# EAGLE board Register Board 2.1 (EAGLE 6.5.0), part 1 of 2
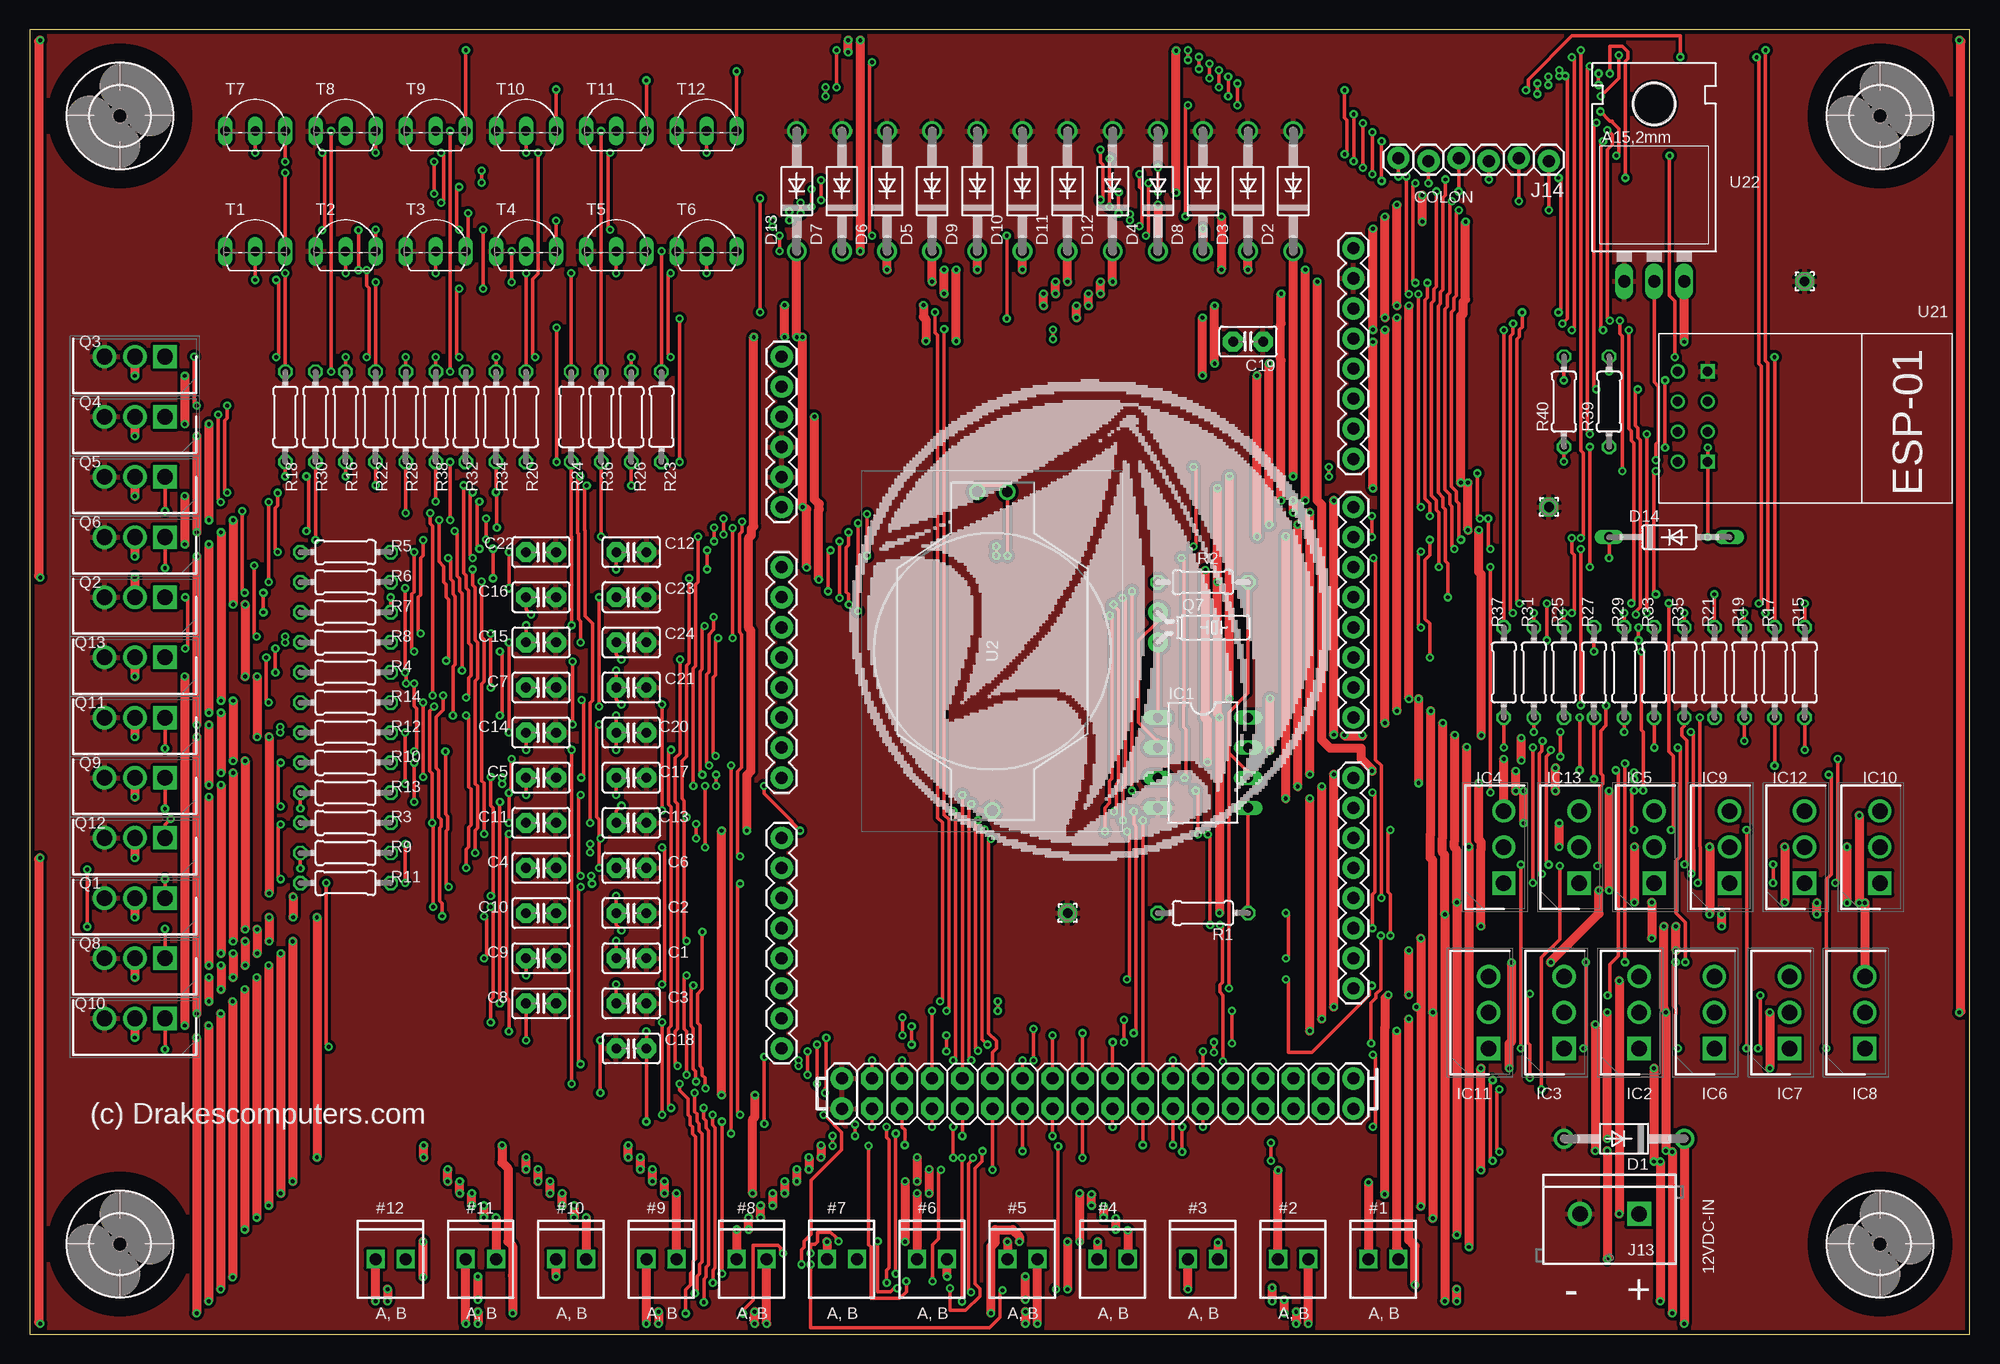
[diagram p3: board, top side]
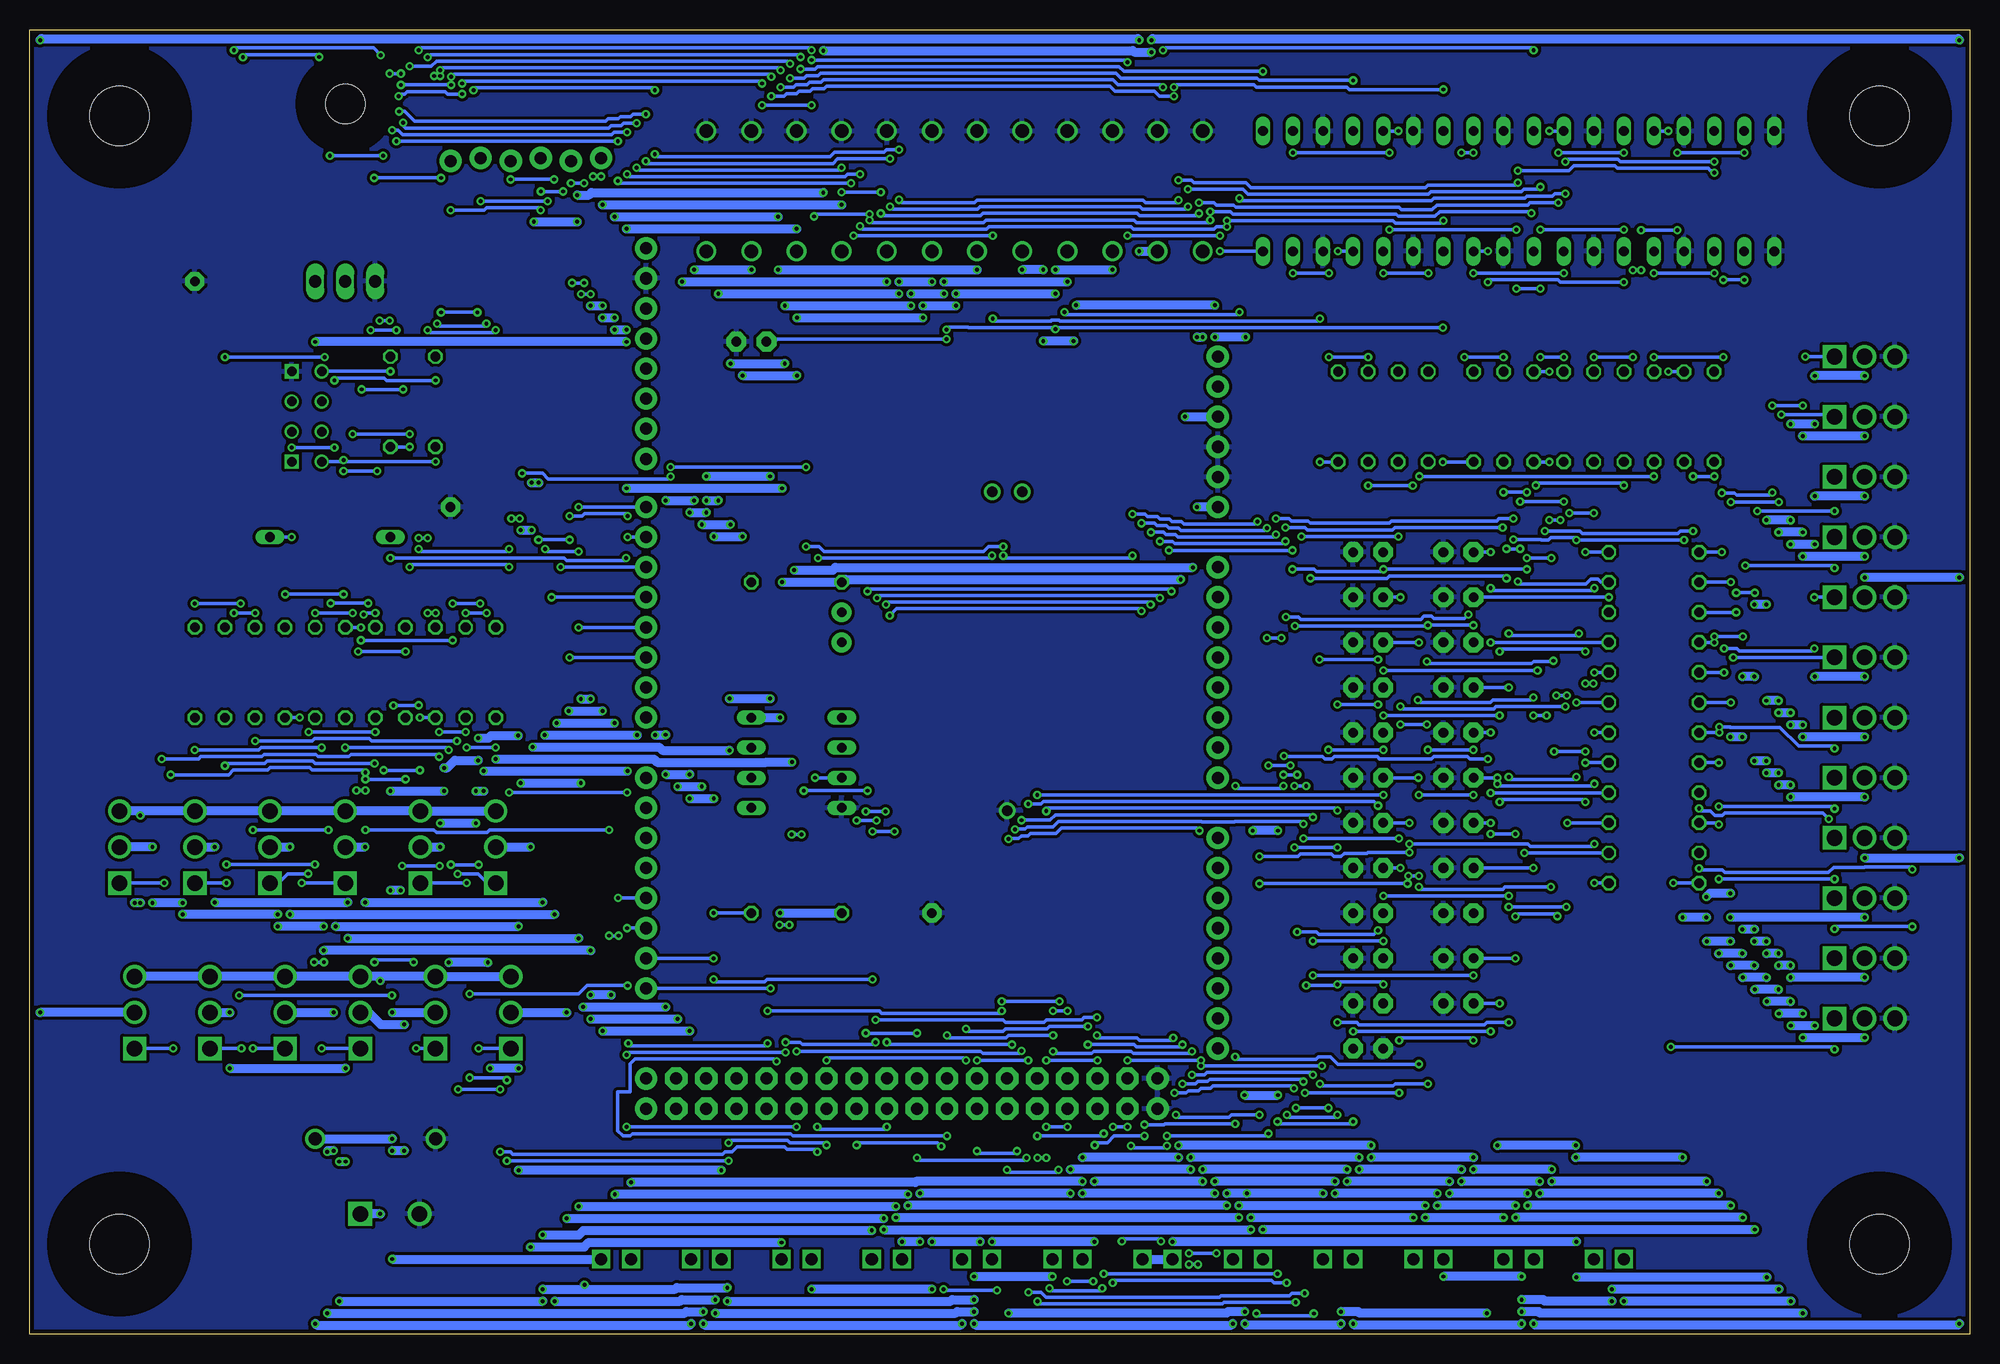
[diagram p4: board, bottom side, seen from below]

Size 163.81 x 110.16 mm. Coordinates in mm from the lower left corner, seen from the top.
Outline: 0,0 163.81,0 163.81,110.16 0,110.16 0,0
Copper layers (1*16): Top 0.0356mm / dielectric 1.5011mm / Bottom 0.0356mm
Design rules "OSH PCB Rules": minimum track width 6mil, minimum drill 13mil, track to track 6mil, track to pad 6mil, pad to pad 6mil, via to via 6mil, smd to smd 6mil, copper to edge 15mil, drill to drill 6mil, minimum pad ring 7mil, minimum via ring 7mil, stop-mask expansion 3mil, vias tented up to drill 13mil, thermal gap 10mil
Net classes: 0 default: width 0.305 mm, clearance 0.254 mm; 1 PWR: width 0.762 mm, clearance 0.254 mm

## Footprints (pad centres in the part's own frame; a part is rotated, then mirrored left to right if it is on the bottom)
C025-025X050 = drill 0.813 pad 1.676 octagon: 1 -1.27,0; 2 1.27,0
DO41-10 = drill 1.118: A 5.08,0; C -5.08,0
DO35-10 = drill 0.813 long: A 5.08,0; C -5.08,0
5,0 = hole 5: 0,0
DIL08 = drill 0.813 long: 1 -3.81,-3.81; 2 -1.27,-3.81; 3 1.27,-3.81; 4 3.81,-3.81; 5 3.81,3.81; 6 1.27,3.81; 7 -1.27,3.81; 8 -3.81,3.81
TO304P498X1010X2089-3P = drill 1.31 pad 1.965 square: 1 0,0 | drill 1.31 pad 1.965: 2 3.04,0; 3 6.08,0
1X02_2.54_SCREWTERM = drill 1.016 square: P1 2.54,0; P2 0,0
SCREWTERMINAL-5MM-2 = drill 1.3 pad 2.032 square: 1 0,0 | drill 1.3 pad 2.032: 2 5,0
1X06_LOCK = drill 1.016 pad 1.88: 1 0,0; 2 2.54,-0.254; 3 5.08,0; 4 7.62,-0.254; 5 10.16,0; 6 12.7,-0.254
1,6/0,8 = drill 0.813 pad 1.6 octagon: 1 0,0
TO255P460X1020X2008-3P = drill 1.32 pad 1.98 square: 1 0,0 | drill 1.32 pad 1.98: 2 2.55,0; 3 5.1,0
TC26H = drill 0.813 pad 1.676: 1 -1.27,0; 2 1.27,0
0204/7 = drill 0.813 octagon: 1 -3.81,0; 2 3.81,0
TO92-EBC-OVAL = drill 0.813 long: B 0,-1.27; C 2.54,-1.27; E -2.54,-1.27
ARDUINO_MEGA_PINSONLY = drill 1.016 pad 1.88: 0 16.51,22.86; 1 13.97,22.86; 2 11.43,22.86; 3 8.89,22.86; 3.3V -11.43,-25.4; 4 6.35,22.86; 5 3.81,22.86; 5V@0 -8.89,-25.4; 5V@1 46.99,22.86; 5V@2 49.53,22.86; 6 1.27,22.86; 7 -1.27,22.86; 8 -5.334,22.86; 9 -7.874,22.86; 10 -10.414,22.86; 11 -12.954,22.86; 12 -15.494,22.86; 13 -18.034,22.86; 14 21.59,22.86; 15 24.13,22.86; 16 26.67,22.86; 17 29.21,22.86; 18 31.75,22.86; 19 34.29,22.86; 20 36.83,22.86; 21 39.37,22.86; A0 3.81,-25.4; A1 6.35,-25.4; A2 8.89,-25.4; A3 11.43,-25.4; A4 13.97,-25.4; A5 16.51,-25.4; A6 19.05,-25.4; A7 21.59,-25.4; A8 26.67,-25.4; A9 29.21,-25.4; A10 31.75,-25.4; A11 34.29,-25.4; A12 36.83,-25.4; A13 39.37,-25.4; A14 41.91,-25.4; A15 44.45,-25.4; AREF -23.114,22.86; GND@0 -6.35,-25.4; GND@1 -3.81,-25.4; GND@2 46.99,-20.32; GND@3 49.53,-20.32; GND@4 -20.574,22.86; RESET -13.97,-25.4; VIN -1.27,-25.4 | drill 1.016 pad 1.88 octagon: 22 46.99,20.32; 23 49.53,20.32; 24 46.99,17.78; 25 49.53,17.78; 26 46.99,15.24; 27 49.53,15.24; 28 46.99,12.7; 29 49.53,12.7; 30 46.99,10.16; 31 49.53,10.16; 32 46.99,7.62; 33 49.53,7.62; 34 46.99,5.08; 35 49.53,5.08; 36 46.99,2.54; 37 49.53,2.54; 38 46.99,0; 39 49.53,0; 40 46.99,-2.54; 41 49.53,-2.54; 42 46.99,-5.08; 43 49.53,-5.08; 44 46.99,-7.62; 45 49.53,-7.62; 46 46.99,-10.16; 47 49.53,-10.16; 48 46.99,-12.7; 49 49.53,-12.7; 50 46.99,-15.24; 51 49.53,-15.24; 52 46.99,-17.78; 53 49.53,-17.78
HU2032LF = drill 0.9 pad 1.4: 1 0,0; 2 0,-2.54; 3 26.9,-1.27
ESP01 = drill 0.8: CH_PD -1.285,-8.178; GPIO0 1.255,-5.638; GPIO2 -1.285,-5.638; RST 1.255,-8.178; TX -3.825,-8.178; VCC 3.795,-8.178 | drill 0.8 square: GND -3.825,-5.638; RX 3.795,-5.638
78XXL = drill 1.016 long: GND 0,-3.81; IN -2.54,-3.81; OUT 2.54,-3.81 | hole 3.302: 0,11.176

## Placement (x,y rotation side)
C1  0.1uf  [C025-025X050]  50.8,31.75 180 top
C2  0.1uf  [C025-025X050]  50.8,35.56 180 top
C3  0.1uf  [C025-025X050]  50.8,27.94 180 top
C4  0.1uf  [C025-025X050]  43.18,39.37 180 top
C5  0.1uf  [C025-025X050]  43.18,46.99 180 top
C6  0.1uf  [C025-025X050]  50.8,39.37 180 top
C7  0.1uf  [C025-025X050]  43.18,54.61 180 top
C8  0.1uf  [C025-025X050]  43.18,27.94 180 top
C9  0.1uf  [C025-025X050]  43.18,31.75 180 top
C10  0.1uf  [C025-025X050]  43.18,35.56 180 top
C11  0.1uf  [C025-025X050]  43.18,43.18 180 top
C12  0.1uf  [C025-025X050]  50.8,66.04 180 top
C13  0.1uf  [C025-025X050]  50.8,43.18 180 top
C14  0.1uf  [C025-025X050]  43.18,50.8 180 top
C15  0.1uf  [C025-025X050]  43.18,58.42 180 top
C16  0.1uf  [C025-025X050]  43.18,62.23 180 top
C17  0.1uf  [C025-025X050]  50.8,46.99 180 top
C18  0.1uf  [C025-025X050]  50.8,24.13 0 top
C19  0.1uf  [C025-025X050]  102.87,83.82 180 top
C20  0.1uf  [C025-025X050]  50.8,50.8 180 top
C21  0.1uf  [C025-025X050]  50.8,54.61 180 top
C22  0.1uf  [C025-025X050]  43.18,66.04 180 top
C23  0.1uf  [C025-025X050]  50.8,62.23 180 top
C24  0.1uf  [C025-025X050]  50.8,58.42 180 top
D1  1N4007  [DO41-10]  134.62,16.51 180 top
D2  1N4007  [DO41-10]  106.68,96.52 90 top
D3  1N4007  [DO41-10]  102.87,96.52 90 top
D4  1N4007  [DO41-10]  95.25,96.52 90 top
D5  1N4007  [DO41-10]  76.2,96.52 90 top
D6  1N4007  [DO41-10]  72.39,96.52 90 top
D7  1N4007  [DO41-10]  68.58,96.52 90 top
D8  1N4007  [DO41-10]  99.06,96.52 90 top
D9  1N4007  [DO41-10]  80.01,96.52 90 top
D10  1N4007  [DO41-10]  83.82,96.52 90 top
D11  1N4007  [DO41-10]  87.63,96.52 90 top
D12  1N4007  [DO41-10]  91.44,96.52 90 top
D13  1N4007  [DO41-10]  64.77,96.52 90 top
D14  1N4148  [DO35-10]  138.43,67.31 0 top
H1  MOUNT-HOLE5.0  [5,0]  7.62,102.87 0 top
H2  MOUNT-HOLE5.0  [5,0]  7.62,7.62 0 top
H3  MOUNT-HOLE5.0  [5,0]  156.21,7.62 0 top
H4  MOUNT-HOLE5.0  [5,0]  156.21,102.87 0 top
IC1  DS1307  [DIL08]  99.06,48.26 270 top
IC2  TIP126  [TO304P498X1010X2089-3P]  135.89,24.13 90 top
IC3  TIP126  [TO304P498X1010X2089-3P]  129.54,24.13 90 top
IC4  TIP126  [TO304P498X1010X2089-3P]  124.46,38.1 90 top
IC5  TIP126  [TO304P498X1010X2089-3P]  137.16,38.1 90 top
IC6  TIP126  [TO304P498X1010X2089-3P]  142.24,24.13 90 top
IC7  TIP126  [TO304P498X1010X2089-3P]  148.59,24.13 90 top
IC8  TIP126  [TO304P498X1010X2089-3P]  154.94,24.13 90 top
IC9  TIP126  [TO304P498X1010X2089-3P]  143.51,38.1 90 top
IC10  TIP126  [TO304P498X1010X2089-3P]  156.21,38.1 90 top
IC11  TIP126  [TO304P498X1010X2089-3P]  123.19,24.13 90 top
IC12  TIP126  [TO304P498X1010X2089-3P]  149.86,38.1 90 top
IC13  TIP126  [TO304P498X1010X2089-3P]  130.81,38.1 90 top
J1  [1X02_2.54_SCREWTERM]  113.03,6.35 0 top
J2  [1X02_2.54_SCREWTERM]  105.41,6.35 0 top
J3  [1X02_2.54_SCREWTERM]  97.79,6.35 0 top
J4  [1X02_2.54_SCREWTERM]  90.17,6.35 0 top
J5  [1X02_2.54_SCREWTERM]  82.55,6.35 0 top
J6  [1X02_2.54_SCREWTERM]  74.93,6.35 0 top
J7  [1X02_2.54_SCREWTERM]  67.31,6.35 0 top
J8  [1X02_2.54_SCREWTERM]  59.69,6.35 0 top
J9  [1X02_2.54_SCREWTERM]  52.07,6.35 0 top
J10  [1X02_2.54_SCREWTERM]  44.45,6.35 0 top
J11  [1X02_2.54_SCREWTERM]  36.83,6.35 0 top
J12  [1X02_2.54_SCREWTERM]  29.21,6.35 0 top
J13  [SCREWTERMINAL-5MM-2]  135.89,10.16 180 top
J14  [1X06_LOCK]  128.27,99.06 180 top
PAD2  [1,6/0,8]  87.63,35.56 0 top
PAD3  [1,6/0,8]  128.27,69.85 0 top
PAD4  [1,6/0,8]  149.86,88.9 0 top
Q1  TIP120  [TO255P460X1020X2008-3P]  11.43,36.83 180 top
Q2  TIP120  [TO255P460X1020X2008-3P]  11.43,62.23 180 top
Q3  TIP120  [TO255P460X1020X2008-3P]  11.43,82.55 180 top
Q4  TIP120  [TO255P460X1020X2008-3P]  11.43,77.47 180 top
Q5  TIP120  [TO255P460X1020X2008-3P]  11.43,72.39 180 top
Q6  TIP120  [TO255P460X1020X2008-3P]  11.43,67.31 180 top
Q7  [TC26H]  95.25,59.69 270 top
Q8  TIP120  [TO255P460X1020X2008-3P]  11.43,31.75 180 top
Q9  TIP120  [TO255P460X1020X2008-3P]  11.43,46.99 180 top
Q10  TIP120  [TO255P460X1020X2008-3P]  11.43,26.67 180 top
Q11  TIP120  [TO255P460X1020X2008-3P]  11.43,52.07 180 top
Q12  TIP120  [TO255P460X1020X2008-3P]  11.43,41.91 180 top
Q13  TIP120  [TO255P460X1020X2008-3P]  11.43,57.15 180 top
R1  4k7  [0204/7]  99.06,35.56 180 top
R2  4k7  [0204/7]  99.06,63.5 180 top
R3  1K  [0204/7]  26.67,43.18 0 top
R4  1K  [0204/7]  26.67,55.88 0 top
R5  1K  [0204/7]  26.67,66.04 0 top
R6  1K  [0204/7]  26.67,63.5 0 top
R7  1K  [0204/7]  26.67,60.96 0 top
R8  1K  [0204/7]  26.67,58.42 0 top
R9  1K  [0204/7]  26.67,40.64 0 top
R10  1K  [0204/7]  26.67,48.26 0 top
R11  1K  [0204/7]  26.67,38.1 0 top
R12  1K  [0204/7]  26.67,50.8 0 top
R13  1K  [0204/7]  26.67,45.72 0 top
R14  1K  [0204/7]  26.67,53.34 0 top
R15  1K  [0204/7]  149.86,55.88 90 top
R16  1K  [0204/7]  26.67,77.47 270 top
R17  1K  [0204/7]  147.32,55.88 90 top
R18  1K  [0204/7]  21.59,77.47 270 top
R19  1K  [0204/7]  144.78,55.88 90 top
R20  1K  [0204/7]  41.91,77.47 270 top
R21  1K  [0204/7]  142.24,55.88 90 top
R22  1K  [0204/7]  29.21,77.47 270 top
R23  1K  [0204/7]  53.34,77.47 90 top
R24  1K  [0204/7]  45.72,77.47 270 top
R25  1K  [0204/7]  129.54,55.88 90 top
R26  1K  [0204/7]  50.8,77.47 270 top
R27  1K  [0204/7]  132.08,55.88 90 top
R28  1K  [0204/7]  31.75,77.47 270 top
R29  1K  [0204/7]  134.62,55.88 90 top
R30  1K  [0204/7]  24.13,77.47 270 top
R31  1K  [0204/7]  127,55.88 90 top
R32  1K  [0204/7]  36.83,77.47 270 top
R33  1K  [0204/7]  137.16,55.88 90 top
R34  1K  [0204/7]  39.37,77.47 270 top
R35  1K  [0204/7]  139.7,55.88 90 top
R36  1K  [0204/7]  48.26,77.47 270 top
R37  1K  [0204/7]  124.46,55.88 90 top
R38  1K  [0204/7]  34.29,77.47 270 top
R39  100  [0204/7]  133.35,78.74 90 top
R40  4.7K  [0204/7]  129.54,78.74 90 top
T1  2N2222  [TO92-EBC-OVAL]  19.05,92.71 0 top
T2  2N2222  [TO92-EBC-OVAL]  26.67,92.71 0 top
T3  2N2222  [TO92-EBC-OVAL]  34.29,92.71 0 top
T4  2N2222  [TO92-EBC-OVAL]  41.91,92.71 0 top
T5  2N2222  [TO92-EBC-OVAL]  49.53,92.71 0 top
T6  2N2222  [TO92-EBC-OVAL]  57.15,92.71 0 top
T7  2N2222  [TO92-EBC-OVAL]  19.05,102.87 0 top
T8  2N2222  [TO92-EBC-OVAL]  26.67,102.87 0 top
T9  2N2222  [TO92-EBC-OVAL]  34.29,102.87 0 top
T10  2N2222  [TO92-EBC-OVAL]  41.91,102.87 0 top
T11  2N2222  [TO92-EBC-OVAL]  49.53,102.87 0 top
T12  2N2222  [TO92-EBC-OVAL]  57.15,102.87 0 top
U1  ARDUINO-MEGA  [ARDUINO_MEGA_PINSONLY]  88.9,68.58 270 top
U2  HU2032-LF  [HU2032LF]  82.55,71.12 270 top
U21  ESP01  [ESP01]  147.32,77.47 270 top
U22  V_REG_LD1117V33  [78XXL]  137.16,92.71 0 top
U$1  [DCLOGO]  68.58,39.37 0 top

## Tracks (layer width: path | path; a pad name or v marks a point on that pad's centre or on a via)
1A  (via drill 0.33)
  Top 0.305: v34.16,53.01 33.78,52.63 33.78,47.55 33.98,47.35 v33.98,43.18 34.06,43.05 v34.06,36.07 | v48.08,62.23 v48.08,53.01 | v71.12,17.5 U1.53 | v72.34,17.5 72.36,17.48 72.36,16.64 72.57,16.43 72.57,5.61 72.36,5.41 v72.36,4.34 | v57.68,4.34 57.68,5.41 57.89,5.61 57.89,17.45 57.66,17.68 v57.66,18.52 | v53.39,26.34 v53.39,18.52 | v38.94,26.34 38.94,28.25 39.14,28.45 39.14,35.87 v38.94,36.07
  Bottom 0.305: v33.98,43.18 R3.2 | v34.16,53.01 40.01,53.01 40.21,52.81 47.88,52.81 v48.08,53.01 | C23.2 v48.08,62.23 | v72.34,17.5 v71.12,17.5 | v72.36,4.34 72.16,4.55 58.95,4.55 58.75,4.34 v57.68,4.34 | v57.66,18.52 57.45,18.31 53.59,18.31 v53.39,18.52 | v53.39,26.34 51.77,26.34 51.56,26.14 40.97,26.14 40.77,26.34 v38.94,26.34 | v34.06,36.07 v38.94,36.07
1A_OUT  (via drill 0.33)
  Top 0.762: v113.03,12.83 J1.P2 | v74.93,14.94 v74.93,12.9 | v66.8,15.95 v66.8,14.94 | v50.55,14.94 v50.55,15.95 | v41.91,13.92 v41.91,14.94 | v35.31,12.9 v35.31,13.92 | v22.23,33.17 v22.23,12.9 | v20.22,35.2 v20.22,33.17 | v8.89,35.2 Q1.2
  Bottom 0.762: v113.03,12.83 89.05,12.83 88.98,12.9 v74.93,12.9 | v66.8,14.94 v74.93,14.94 | v50.55,15.95 v66.8,15.95 | v41.91,14.94 v50.55,14.94 | v35.31,13.92 v41.91,13.92 | v22.23,12.9 v35.31,12.9 | v20.22,33.17 v22.23,33.17 | v8.89,35.2 v20.22,35.2
1B  (via drill 0.33)
  Top 0.305: v26.67,72.44 R16.2 | v46.48,72.44 46.28,72.24 46.28,67.64 46.33,67.59 46.33,60.38 46.53,60.17 v46.53,58.42 | v71.12,23.14 U1.52 | v64.92,22.66 v64.92,23.14 | v54.71,22.66 54.51,22.86 54.51,25.58 54.71,25.78 54.71,44.78 54.51,44.98 54.51,48.64 54.91,49.05 v54.91,56.97 | v49.96,56.97 49.53,57.4 C24.2
  Bottom 0.305: v46.48,72.44 v26.67,72.44 | C24.2 v46.53,58.42 | v64.92,23.14 v71.12,23.14 | v54.71,22.66 v64.92,22.66 | v49.96,56.97 v54.91,56.97
1B_OUT  (via drill 0.33)
  Top 0.762: v133.2,15.49 v133.2,6.35 | v132.18,26.16 v132.18,15.49 | v72.39,89.89 D6.C | v77.22,87.86 v77.22,89.89 | v85.6,86.84 v85.6,87.86 | v88.39,85.83 v88.39,86.84 | v99.03,80.95 v99.03,85.83 | v103.63,67.36 v103.63,80.95 | v106.05,45.24 v106.05,67.36 | v108.08,25.6 v108.08,45.24 | v115.42,25.6 115.42,7.21 115.57,7.06 J1.P1
  Bottom 0.762: v133.2,6.35 J1.P1 | v132.18,15.49 v133.2,15.49 | v132.18,26.16 134.16,26.16 135.18,27.18 IC2.2 | v77.22,89.89 v72.39,89.89 | v85.6,87.86 v77.22,87.86 | v88.39,86.84 v85.6,86.84 | v99.03,85.83 v88.39,85.83 | v103.63,80.95 v99.03,80.95 | v106.05,67.36 v103.63,67.36 | v108.08,45.24 v106.05,45.24 | v115.42,25.6 v108.08,25.6
2A  (via drill 0.33)
  Top 0.305: v31.7,62.99 v31.7,55.88 31.77,55.75 v31.77,54.94 | v40.46,66.04 v40.46,62.99 | U1.51 73.66,17.48 73.89,17.25 v73.89,15.98 | v69.7,17.7 v69.7,16.74 | v62.03,23.42 v62.03,17.75 | v46.53,22.81 46.33,23.01 46.33,37.57 v46.53,37.77 | v35.38,37.77 35.18,37.97 35.18,42.49 35.31,42.62 35.31,43.74 35.1,43.94 v35.1,49.2 | v32.46,49.2 32.66,49.4 32.66,52.83 32.46,53.03 v32.46,54.94
  Bottom 0.305: v31.7,55.88 R4.2 | v31.7,62.99 31.9,62.79 40.26,62.79 v40.46,62.99 | C22.2 v40.46,66.04 | v73.89,15.98 73.69,16.18 72.82,16.18 72.26,16.74 v69.7,16.74 | v69.7,17.7 68.02,17.7 67.97,17.75 v62.03,17.75 | v62.03,23.42 61.82,23.22 55.22,23.22 55.02,23.42 53.98,23.42 53.37,22.81 v46.53,22.81 | v46.53,37.77 46.33,37.57 39.45,37.57 39.24,37.77 v35.38,37.77 | v32.46,49.2 v35.1,49.2 | v31.77,54.94 v32.46,54.94
2A_OUT  (via drill 0.33)
  Top 0.762: v8.89,63.91 Q2.2 | v0.89,63.91 0.76,64.03 0.76,109.14 v0.89,109.27 | v69.11,108.25 v69.11,109.27 | v96.8,96.39 v96.8,108.38 | v117.58,93.93 v117.58,96.19 | v121.23,93.93 121.23,87.38 121.03,87.17 121.03,86.18 120.83,85.98 v120.83,71.91 | v121.44,67.89 v121.44,71.91 | v122.35,67.89 122.35,64.36 122.56,64.16 v122.56,50.55 | v125.93,48.46 v125.93,50.34 | v128.83,45.87 v128.83,47.83 | v133.35,37.49 v133.35,45.87 | v132.49,37.49 132.49,35.53 128.42,31.47 v128.42,31.39 | v125.12,31.39 125.12,24.74 124.92,24.54 v124.92,22.45 | v122.53,13.84 v122.53,22.45 | J2.P2 v105.41,13.84
  Bottom 0.762: v0.89,63.91 v8.89,63.91 | v0.89,109.27 1.02,109.4 68.99,109.4 v69.11,109.27 | v69.11,108.25 70.54,108.25 70.66,108.38 v96.8,108.38 | v96.8,96.39 116.38,96.39 116.59,96.19 v117.58,96.19 | v121.23,93.93 v117.58,93.93 | v121.44,71.91 v120.83,71.91 | v122.35,67.89 v121.44,67.89 | v122.56,50.55 124.87,50.55 125.07,50.34 v125.93,50.34 | v125.93,48.46 127.91,48.46 128.55,47.83 v128.83,47.83 | v133.35,45.87 v128.83,45.87 | v132.49,37.49 v133.35,37.49 | v125.12,31.39 v128.42,31.39 | v122.53,22.45 v124.92,22.45 | v105.41,13.84 v122.53,13.84
2B  (via drill 0.33)
  Top 0.305: v21.59,72.44 R18.2 | v23.37,72.44 23.57,72.24 23.57,68.02 v23.37,67.82 | v35.89,67.82 36.09,67.61 36.09,64.03 36.3,63.83 36.3,62.74 36.5,62.53 v36.5,56.06 | v49.53,56.06 C21.2 49.53,53.59 v49.96,53.16 | v73.66,23.14 U1.50 | v77.98,23.14 78.18,23.34 78.18,43.97 v77.98,44.17 | v53.39,53.16 v53.39,44.22
  Bottom 0.305: v23.37,72.44 v21.59,72.44 | v23.37,67.82 24.43,67.82 24.64,67.61 32.72,67.61 32.92,67.82 v35.89,67.82 | v49.53,56.06 v36.5,56.06 | v77.98,23.14 v73.66,23.14 | v77.98,44.17 77.98,44.42 53.59,44.42 v53.39,44.22 | v49.96,53.16 v53.39,53.16
2B_OUT  (via drill 0.33)
  Top 0.762: v107.95,0.89 J2.P1 | D1.C v139.7,0.89 | v133.2,16.51 v133.2,27.18
  Bottom 0.762: v107.95,0.89 108.08,0.76 139.57,0.76 v139.7,0.89 | v133.2,27.18 IC3.2 | D1.C v133.2,16.51
3A  (via drill 0.33)
  Top 0.305: v32.46,66.04 32.46,62.69 32.26,62.48 32.26,57.86 v32.46,57.66 | v39.7,57.66 39.9,57.45 39.9,52.45 v39.7,52.25 | v49.53,52.25 C20.2 v49.53,49.35 | v76.2,17.5 U1.49 | v77.98,14.91 v77.98,17.5 | v78.72,2.77 v78.72,14.91 | v56.92,2.69 56.92,4.65 57.12,4.85 57.12,5.66 57.33,5.87 57.33,17.2 57.1,17.42 57.1,18.01 56.9,18.21 v56.9,19.1 | v54.15,19.1 53.95,19.3 53.95,25.83 54.15,26.04 54.15,44.53 53.95,44.73 53.95,49.15 v54.15,49.35
  Bottom 0.305: v32.46,66.04 R5.2 | v32.46,57.66 32.66,57.86 39.5,57.86 v39.7,57.66 | v49.53,52.25 v39.7,52.25 | v77.98,17.5 v76.2,17.5 | v78.72,14.91 v77.98,14.91 | v78.72,2.77 78.51,2.56 63.09,2.56 62.97,2.69 v56.92,2.69 | v54.15,19.1 v56.9,19.1 | v49.53,49.35 v54.15,49.35
3A_OUT  (via drill 0.33)
  Top 0.762: v97.79,3.81 J3.P2 | v87.63,7.82 v87.63,3.81 | v83.57,7.82 83.57,8.26 82.98,8.84 81.53,8.84 81.53,7.77 81.15,7.39 v81.15,1.78 | v61.21,0.89 v61.21,1.91 | v53.09,1.91 v53.09,0.89 | v40.79,1.78 40.79,4.93 40.77,4.95 40.77,7.47 40.39,7.85 40.39,13.99 39.88,14.5 v39.88,15.95 | v33.27,14.94 v33.27,15.95 | v24.26,35.2 v24.26,14.94 | v22.25,36.93 v22.25,35.2 | v20.22,50.44 v20.22,37.24 | v19.2,55.52 v19.2,50.44 | v18.19,61.62 v18.19,55.52 | v17.17,68.73 v17.17,61.62 | v15.14,76.86 v15.14,68.73 | v13.11,80.92 v13.11,76.86 | v8.89,80.92 Q3.2
  Bottom 0.762: v87.63,3.81 v97.79,3.81 | v83.57,7.82 v87.63,7.82 | v81.15,1.78 62.76,1.78 62.64,1.91 v61.21,1.91 | v61.21,0.89 61.09,0.76 53.21,0.76 v53.09,0.89 | v53.09,1.91 51.66,1.91 51.54,1.78 v40.79,1.78 | v33.27,15.95 v39.88,15.95 | v24.26,14.94 v33.27,14.94 | v22.25,35.2 v24.26,35.2 | v22.25,36.93 21.95,37.24 v20.22,37.24 | v19.2,50.44 v20.22,50.44 | v18.19,55.52 v19.2,55.52 | v17.17,61.62 v18.19,61.62 | v15.14,68.73 v17.17,68.73 | v13.11,76.86 v15.14,76.86 | v8.89,80.92 v13.11,80.92
3B  (via drill 0.33)
  Top 0.305: v44.5,84.99 v44.5,73.66 | v86.39,84.02 v86.39,84.84 | v76.2,27.3 U1.48 | v77.42,27.3 77.62,27.51 77.62,43.46 77.22,43.87 v77.22,84.86
  Bottom 0.305: v44.5,73.66 R20.2 | 77.22,84.99 84.53,84.99 84.58,85.04 86.18,85.04 v86.39,84.84 | 77.22,84.99 v44.5,84.99 | v86.39,84.02 100.69,84.02 100.89,83.82 C19.2 | v77.42,27.3 v76.2,27.3 | v77.22,84.86 77.22,84.99
3B_OUT  (via drill 0.33)
  Top 0.762: v100.33,7.75 J3.P1 | v121.51,7.37 v121.51,41.15 121.34,41.5 v121.34,49.58 | v106.68,72.44 D2.C | v101.3,53.67 v101.3,72.44 | v104.72,49.3 v104.72,53.67
  Bottom 0.762: v100.33,7.75 116.61,7.75 116.99,7.37 v121.51,7.37 | v121.51,41.15 IC4.2 | v101.3,72.44 v106.68,72.44 | v104.72,53.67 v101.3,53.67 | v104.72,49.3 110.39,49.3 110.67,49.58 v121.34,49.58
4A  (via drill 0.33)
  Top 0.305: v38.18,63.55 38.18,58.88 38.38,58.67 38.38,55.12 38.18,54.91 38.18,46.74 38.38,46.53 v38.38,42.24 | v40.46,42.24 40.26,42.04 40.26,28.45 40.46,28.25 v40.46,25.58 | v52.07,25.58 C18.2 v52.07,17.96 | v78.74,16.74 U1.47 | v73.13,5.11 v73.13,16.94 | v58.45,17.96 v58.45,5.11
  Bottom 0.305: R6.2 31.14,63.5 31.39,63.75 32,63.75 32.41,63.35 37.97,63.35 v38.18,63.55 | v40.46,42.24 v38.38,42.24 | v52.07,25.58 v40.46,25.58 | v78.74,16.74 73.33,16.74 v73.13,16.94 | v58.45,5.11 v73.13,5.11 | v58.45,17.96 58.24,17.75 52.27,17.75 v52.07,17.96
4A_OUT  (via drill 0.33)
  Top 0.762: v90.17,7.82 J4.P2 | v88.65,11.89 v88.65,7.82 | v75.95,13.92 v75.95,11.89 | v65.79,14.94 v65.79,13.92 | v51.56,13.92 v51.56,14.94 | v42.93,12.9 v42.93,13.92 | v36.32,11.89 v36.32,12.9 | v21.21,32.16 v21.21,11.89 | v19.2,34.19 v19.2,32.16 | v18.19,48.41 v18.19,34.19 | v17.17,53.49 v17.17,48.41 | v16.15,67.72 v16.15,53.49 | v14.12,75.84 v14.12,67.72 | v8.89,75.84 Q4.2
  Bottom 0.762: v88.65,7.82 v90.17,7.82 | v75.95,11.89 v88.65,11.89 | v65.79,13.92 v75.95,13.92 | v51.56,14.94 v65.79,14.94 | v42.93,13.92 v51.56,13.92 | v36.32,12.9 v42.93,12.9 | v21.21,11.89 v36.32,11.89 | v19.2,32.16 v21.21,32.16 | v18.19,34.19 v19.2,34.19 | v17.17,48.41 v18.19,48.41 | v16.15,53.49 v17.17,53.49 | v14.12,67.72 v16.15,67.72 | v8.89,75.84 v14.12,75.84
4B  (via drill 0.33)
  Top 0.305: v29.21,71.68 R22.2 | v36.65,71.68 36.65,64.29 36.85,64.08 36.85,62.99 37.06,62.79 37.06,58.37 37.26,58.17 37.26,55.63 37.06,55.42 37.06,53.98 v36.85,53.77 | v46.61,53.57 46.74,53.44 46.74,53.34 46.76,53.31 46.76,47.19 v46.56,46.99 | v78.74,45.54 U1.46 | C17.2 v49.53,45.54
  Bottom 0.305: v29.21,71.68 29.41,71.88 36.45,71.88 v36.65,71.68 | v36.85,53.77 37.06,53.57 40.26,53.57 40.46,53.37 46.41,53.37 v46.61,53.57 | C17.2 v46.56,46.99 | v49.53,45.54 v78.74,45.54
4B_OUT  (via drill 0.33)
  Top 0.762: v92.71,8.76 J4.P1 | v120.5,8.38 v120.5,36.47 120.5,40.89 120.29,41.1 120.29,41.66 120.32,41.68 v120.32,50.6 | v135.48,41.15 v135.48,36.47 | v102.87,89.89 D3.C | v107.7,70.41 v107.7,89.89 | v110.11,50.62 v110.11,70.41 | v111,50.6 111.1,50.49 112.52,50.49 v112.52,50.6
  Bottom 0.762: v92.71,8.76 117.04,8.76 117.42,8.38 v120.5,8.38 | v135.48,36.47 v120.5,36.47 | v135.48,41.15 IC5.2 | v107.7,89.89 v102.87,89.89 | v110.11,70.41 v107.7,70.41 | v110.11,50.62 110.16,50.62 110.19,50.6 v111,50.6 | v120.32,50.6 v112.52,50.6
5A  (via drill 0.33)
  Top 0.305: v30.48,62.23 R7.2 | v81.28,13.89 U1.45 | v76.94,13.89 76.73,13.69 76.73,8.08 76.22,7.57 v76.22,4.47 | v74.02,4.47 74.02,3.58 73.46,3.02 71.04,3.02 71.04,5.16 71.02,5.18 71.02,7.37 70.84,7.54 v70.84,15.93 | v67.79,16.74 v67.79,15.93 | v59.21,48.03 v59.21,16.94 | v57.35,48.03 57.15,48.23 57.15,55.7 57.35,55.91 57.35,59.08 57.76,59.49 v57.76,60.55 | v42.34,60.78 41.91,61.21 C16.2
  Bottom 0.305: C16.2 v30.48,62.23 | v81.28,13.89 81.08,13.69 77.14,13.69 v76.94,13.89 | v74.02,4.47 v76.22,4.47 | v70.84,15.93 70.64,15.72 68,15.72 v67.79,15.93 | v67.79,16.74 59.41,16.74 v59.21,16.94 | v57.35,48.03 v59.21,48.03 | v57.76,60.55 56.69,60.55 56.49,60.35 46.35,60.35 46.08,60.63 45.47,60.63 45.26,60.43 42.7,60.43 v42.34,60.78
5A_OUT  (via drill 0.33)
  Top 0.762: v82.55,7.82 J5.P2 | v73.91,12.9 v73.91,7.82 | v64.77,13.92 v64.77,12.9 | v52.58,12.9 v52.58,13.92 | v43.94,11.89 v43.94,12.9 | v37.34,10.87 v37.34,11.89 | v20.19,31.14 v20.19,10.87 | v18.19,33.17 v18.19,31.14 | v17.17,47.4 v17.17,33.17 | v16.15,52.48 v16.15,47.4 | v15.14,66.7 v15.14,52.48 | v13.11,70.76 v13.11,66.7 | v8.89,70.76 Q5.2
  Bottom 0.762: v73.91,7.82 v82.55,7.82 | v64.77,12.9 v73.91,12.9 | v52.58,13.92 v64.77,13.92 | v43.94,12.9 v52.58,12.9 | v37.34,11.89 v43.94,11.89 | v20.19,10.87 v37.34,10.87 | v18.19,31.14 v20.19,31.14 | v17.17,33.17 v18.19,33.17 | v16.15,47.4 v17.17,47.4 | v15.14,52.48 v16.15,52.48 | v13.11,66.7 v15.14,66.7 | v8.89,70.76 v13.11,70.76
5B  (via drill 0.33)
  Top 0.305: R24.2 45.72,67.39 45.77,67.33 v45.77,59.87 | C15.2 v41.91,59.87 | U1.44 81.28,23.8 81.64,24.16 81.64,24.77 80.97,25.43 80.97,41.63 v81.18,41.83 | v65.05,42.52 64.36,43.2 64.36,43.31 62,45.67 v62,46.3 | v57.96,47.24 v57.96,46.3 | v56.79,47.24 56.59,47.45 56.59,55.96 56.79,56.16 56.79,59.59 v57,59.79
  Bottom 0.305: v41.91,59.87 v45.77,59.87 45.9,59.79 v57,59.79 | v81.18,41.83 81.15,41.86 80.31,41.86 80.09,42.09 79.5,42.09 79.3,42.29 77.17,42.29 76.71,42.75 65.28,42.75 v65.05,42.52 | v62,46.3 61.8,46.1 58.17,46.1 v57.96,46.3 | v56.79,47.24 v57.96,47.24
5B_OUT  (via drill 0.33)
  Top 0.762: v85.09,0.89 J5.P1 | v106.93,1.91 v106.93,0.89 | v138.68,15.42 v138.68,1.78 | v138.15,15.49 v138.15,27.18 137.97,27.53 v137.97,34.44 | v95.25,95.38 D4.C | v115.44,86.84 v115.44,95.38 | v116.46,53.65 v116.46,86.84 | v117.27,46.53 v117.27,53.65 | v122.35,46.53 122.35,41.76 122.56,41.55 122.56,41 122.53,40.97 v122.53,34.44
  Bottom 0.762: v85.09,0.89 85.22,0.76 106.81,0.76 v106.93,0.89 | v106.93,1.91 108.36,1.91 108.48,1.78 v138.68,1.78 | v138.68,15.42 138.61,15.49 v138.15,15.49 | v138.15,27.18 IC6.2 | v115.44,95.38 v95.25,95.38 | v116.46,86.84 v115.44,86.84 | v117.27,53.65 v116.46,53.65 | v122.35,46.53 v117.27,46.53 | v137.97,34.44 v122.53,34.44
6A  (via drill 0.33)
  Top 0.305: v40.46,50.8 v40.46,58.42 | v83.82,15.47 U1.43 | v80.44,15.47 80.42,15.44 80.42,14.61 79.83,14.02 79.83,4.24 80.24,3.83 80.24,3.23 79.02,2.01 77.7,2.01 v77.7,3.89 | v73.25,3.89 72.97,3.89 72.67,3.58 71.6,3.58 v71.6,7.85 | v68.3,7.85 68.07,8.08 68.07,8.18 67.64,8.61 66.52,8.61 66.52,7.82 66.29,7.59 65.94,7.59 v65.94,6.83 | v63.6,6.83 63.4,7.04 63.4,7.29 63.17,7.52 61.06,7.52 61.06,2.87 60.22,2.03 v60.22,1.75 | v55.4,1.75 55.4,3.76 55.8,4.17 55.8,5.16 56.01,5.36 56.01,6.17 56.21,6.38 56.21,16.69 55.98,16.92 55.98,17.5 55.78,17.7 55.78,18.34 55.58,18.54 55.58,19.89 54.86,20.6 v54.86,21.16 | v45.77,49.35 v45.77,21.16 | C14.2 v41.91,49.35
  Bottom 0.305: v40.46,58.42 R8.2 | C14.2 v40.46,50.8 | v83.82,15.47 83.62,15.27 80.64,15.27 v80.44,15.47 | v77.7,3.89 77.5,3.68 73.46,3.68 v73.25,3.89 | v71.6,7.85 71.4,8.05 68.5,8.05 v68.3,7.85 | v63.6,6.83 v65.94,6.83 | v60.22,1.75 60.02,1.55 55.6,1.55 v55.4,1.75 | v54.86,21.16 54.66,20.95 48.69,20.95 48.49,21.16 v45.77,21.16 | v41.91,49.35 v45.77,49.35
6A_OUT  (via drill 0.33)
  Top 0.762: v74.93,11.89 J6.P2 | v63.75,12.9 v63.75,11.89 | v53.59,11.89 v53.59,12.9 | v44.96,10.87 v44.96,11.89 | v38.35,9.86 v38.35,10.87 | v19.18,30.12 v19.18,9.86 | v17.17,32.16 v17.17,30.12 | v16.15,46.38 v16.15,32.16 | v15.14,51.46 v15.14,46.38 | v14.12,65.68 v14.12,51.46 | v8.89,65.68 Q6.2
  Bottom 0.762: v63.75,11.89 v74.93,11.89 | v53.59,12.9 v63.75,12.9 | v44.96,11.89 v53.59,11.89 | v38.35,10.87 v44.96,10.87 | v19.18,9.86 v38.35,9.86 | v17.17,30.12 v19.18,30.12 | v16.15,32.16 v17.17,32.16 | v15.14,46.38 v16.15,46.38 | v14.12,51.46 v15.14,51.46 | v8.89,65.68 v14.12,65.68
6B  (via drill 0.33)
  Top 0.305: v50.8,71.65 R26.2 | v47.04,71.65 46.84,71.45 46.84,67.89 46.89,67.84 46.89,60.63 47.52,59.99 47.52,53.52 47.32,53.31 v47.32,43.18 | v83.82,23.14 U1.42 | v79.5,23.14 79.3,23.34 79.3,44.58 v79.5,44.78 | v49.96,44.63 49.53,44.2 C13.2
  Bottom 0.305: v47.04,71.65 v50.8,71.65 | C13.2 v47.32,43.18 | v79.5,23.14 v83.82,23.14 | v79.5,44.78 78.44,44.78 78.23,44.98 50.32,44.98 v49.96,44.63
6B_OUT  (via drill 0.33)
  Top 0.762: v77.47,4.88 J6.P1 | v84.07,2.92 v84.07,4.88 | v104.9,3.94 v104.9,2.79 | v120.5,2.79 v120.5,3.81 | v137.67,14.58 v137.67,2.79 | v137.13,22.45 v137.13,14.58 | v146.91,27.18 v146.91,22.45 | v76.2,88.88 D5.C | v86.61,87.86 v86.61,88.88 | v89.41,86.84 v89.41,87.86 | v100.05,81.97 v100.05,86.84 | v104.65,68.38 v104.65,81.97 | v107.06,46.25 v107.06,68.38 | v109.09,26.62 v109.09,46.25 | v116.43,26.62 116.43,7.98 116.97,7.44 v116.97,4.17
  Bottom 0.762: v84.07,4.88 v77.47,4.88 | v84.07,2.92 85.9,2.92 86.03,2.79 v104.9,2.79 | v104.9,3.94 109.17,3.94 109.3,3.81 116.97,3.81 | v120.5,3.81 116.97,3.81 | v137.67,2.79 v120.5,2.79 | v137.13,14.58 v137.67,14.58 | v146.91,22.45 v137.13,22.45 | v146.91,27.18 IC7.2 | v86.61,88.88 v76.2,88.88 | v89.41,87.86 v86.61,87.86 | v100.05,86.84 v89.41,86.84 | v104.65,81.97 v100.05,81.97 | v107.06,68.38 v104.65,68.38 | v109.09,46.25 v107.06,46.25 | v116.43,26.62 v109.09,26.62 | v116.97,4.17 116.97,3.81
7A  (via drill 0.33)
  Top 0.305: v37.62,40.64 37.62,42.55 37.82,42.75 37.82,46.28 37.62,46.48 37.62,55.17 37.82,55.37 37.82,58.42 37.62,58.62 37.62,63.04 37.41,63.25 v37.41,64.59 | C12.2 v49.53,64.59 | v86.36,16.74 U1.41 | v100.76,23.04 100.76,28.63 100.48,28.91 100.48,29.52 100.69,29.72 100.69,34.37 v100.48,34.57 | v99.67,34.57 99.67,42.01 v99.47,42.22 | v98.65,42.22 98.65,45.7 v98.45,45.9 | v93.07,62.74 v93.07,45.9 | v67.41,62.74 67.41,65.99 v67.61,66.19 | v57.2,64.59 v57.2,66.19
  Bottom 0.305: v37.62,40.64 R9.2 | v37.41,64.59 v49.53,64.59 49.61,64.47 49.68,64.39 55.17,64.39 55.37,64.59 v57.2,64.59 | v86.36,16.74 99.36,16.74 99.57,16.94 112.9,16.94 113.11,16.74 113.72,16.74 114.17,17.2 114.17,20.47 113.13,20.47 113.11,20.5 113.11,22.84 112.7,23.24 100.97,23.24 v100.76,23.04 | v99.67,34.57 v100.48,34.57 | v98.65,42.22 v99.47,42.22 | v93.07,45.9 v98.45,45.9 | v93.07,62.74 92.86,62.94 67.61,62.94 v67.41,62.74 | v57.2,66.19 v67.61,66.19
7A_OUT  (via drill 0.33)
  Top 0.762: v67.31,7.82 J7.P2 | v33.22,4.83 v33.22,7.82 | v17.14,28.09 v17.14,4.83 | v15.14,30.12 v15.14,28.09 | v8.89,30.12 Q8.2
  Bottom 0.762: J7.P1 J7.P2 | v33.22,7.82 v67.31,7.82 | v17.14,4.83 v33.22,4.83 | v15.14,28.09 v17.14,28.09 | v8.89,30.12 v15.14,30.12
7B  (via drill 0.33)
  Top 0.305: v31.75,69.34 R28.2 | v33.81,69.34 33.81,68.45 34.01,68.25 v34.01,53.95 | v34.92,53.95 34.92,52.7 34.34,52.12 34.34,47.8 34.54,47.6 34.54,43.69 34.75,43.48 34.75,42.88 34.62,42.75 34.62,36.58 34.82,36.37 v34.82,35.31 | v38.38,35.28 38.58,35.08 38.58,31.95 v38.38,31.75 | v86.36,25.22 U1.40 | v77.39,23.9 v77.39,25.22 | v65.68,21.89 v65.68,23.9 | v55.47,21.89 55.47,25.58 55.27,25.78 55.27,30.1 v55.47,30.3 | C9.2 v41.91,30.3
  Bottom 0.305: v33.81,69.34 v31.75,69.34 | v34.92,53.95 v34.01,53.95 | v34.82,35.31 35.03,35.51 38.15,35.51 v38.38,35.28 | C9.2 v38.38,31.75 | v86.36,25.22 86.16,25.02 81.38,25.02 81.18,25.22 v77.39,25.22 | v77.39,23.9 77.19,23.7 74.17,23.7 73.97,23.9 70.81,23.9 70.61,23.7 65.89,23.7 v65.68,23.9 | v65.68,21.89 64.62,21.89 64.41,22.1 55.68,22.1 v55.47,21.89 | v41.91,30.3 v55.47,30.3
7B_OUT  (via drill 0.33)
  Top 0.762: v70.13,109.27 v70.13,91.44 | v162.92,109.27 163.04,109.14 163.04,27.3 v162.92,27.18
  Bottom 0.762: v70.13,91.44 D7.C | v70.13,109.27 70.26,109.4 162.79,109.4 v162.92,109.27 | v162.92,27.18 IC8.2
8A  (via drill 0.33)
  Top 0.305: v32.46,44.96 v32.46,48.26 | v39.7,27.94 v39.7,44.96 | v88.9,14.91 U1.39 | v79.65,14.91 79.48,14.73 79.48,14.61 79.27,14.4 79.27,3.73 v79.48,3.53 | v56.16,3.45 56.36,3.66 56.36,4.9 56.57,5.11 56.57,5.92 56.77,6.12 56.77,16.94 56.54,17.17 56.54,17.75 56.34,17.96 56.34,18.59 56.13,18.8 v56.13,20.4 | v48.18,24.82 v48.18,20.4 | C8.2 v41.91,24.82
  Bottom 0.305: v32.46,48.26 R10.2 | v32.46,44.96 32.66,45.16 39.5,45.16 v39.7,44.96 | C8.2 v39.7,27.94 | v88.9,14.91 88.7,14.71 79.86,14.71 v79.65,14.91 | v79.48,3.53 78.41,3.53 78,3.12 63.35,3.12 63.22,3.25 57.43,3.25 57.23,3.45 v56.16,3.45 | v48.18,20.4 v56.13,20.4 | v48.18,24.82 47.98,25.02 42.11,25.02 v41.91,24.82
8A_OUT  (via drill 0.33)
  Top 0.762: v59.69,8.84 J8.P2 | v18.16,29.11 v18.16,8.84 | v16.15,31.14 v16.15,29.11 | v15.14,45.36 v15.14,31.14 | v8.89,45.36 Q9.2
  Bottom 0.762: v18.16,8.84 v59.69,8.84 | v16.15,29.11 v18.16,29.11 | v15.14,31.14 v16.15,31.14 | v8.89,45.36 v15.14,45.36
8B  (via drill 0.33)
  Top 0.305: v24.13,67.06 R30.2 | v33.22,67.06 33.22,65.73 33.02,65.53 33.02,62.43 32.82,62.23 32.82,59.38 v33.02,59.18 | v38.94,54.61 v38.94,59.18 | v88.9,25.43 U1.38 | v93.22,25.43 93.42,25.63 93.42,42.88 93.22,43.08 v93.22,44.15 | v91.54,44.15 91.75,44.35 91.75,46.46 91.95,46.66 91.95,61.16 v91.49,61.62 | v69.16,61.62 69.14,61.65 69.14,62.48 68.94,62.69 68.94,66.45 69.14,66.65 v69.14,67.72 | v58.57,68.89 v58.57,67.51 | v38.53,67.11 v38.53,68.89
  Bottom 0.305: v24.13,67.06 v33.22,67.06 33.3,67.18 33.38,67.26 35.38,67.26 35.59,67.06 36.2,67.06 36.22,67.08 38.51,67.08 v38.53,67.11 | v33.02,59.18 33.22,58.98 38.73,58.98 v38.94,59.18 | C7.2 v38.94,54.61 | v93.22,25.43 v88.9,25.43 | v91.54,44.15 v93.22,44.15 | v91.49,61.62 91.29,61.82 69.37,61.82 v69.16,61.62 | v69.14,67.72 68.07,67.72 67.87,67.51 67.06,67.51 66.85,67.31 58.78,67.31 v58.57,67.51 | v58.57,68.89 57.48,68.89 57.28,68.68 55.88,68.68 55.68,68.48 49.02,68.48 48.82,68.68 39.95,68.68 39.75,68.89 v38.53,68.89
8B_OUT  (via drill 0.33)
  Top 0.762: v62.23,0.89 J8.P1 | v84.07,1.91 v84.07,0.89 | v105.92,2.92 v105.92,1.78 | v119.48,2.79 v119.48,35.46 119.48,40.46 119.28,40.66 119.28,41.91 119.3,41.94 v119.3,51.61 | v141.83,41.15 v141.83,35.46 | v99.06,93.34 D8.C | v113.41,84.81 v113.41,93.34 | v114.43,51.61 v114.43,84.81
  Bottom 0.762: v62.23,0.89 62.36,0.76 83.95,0.76 v84.07,0.89 | v84.07,1.91 85.5,1.91 85.62,1.78 v105.92,1.78 | v105.92,2.92 108.76,2.92 108.89,2.79 v119.48,2.79 | v141.83,35.46 v119.48,35.46 | v141.83,41.15 IC9.2 | v113.41,93.34 v99.06,93.34 | v114.43,84.81 v113.41,84.81 | v119.3,51.61 v114.43,51.61
9A  (via drill 0.33)
  Top 0.305: v31.7,41.4 v31.7,38.1 | v47.32,40.69 v47.32,41.4 | v59.97,40.34 59.77,40.54 59.77,47.52 60.12,47.88 60.12,59.08 59.92,59.28 59.92,67.56 60.15,67.79 v60.15,68.63 | v70.71,65.73 v70.71,69.24 | v81.61,66.5 v81.61,65.73 | v98.27,66.52 98.48,66.73 98.48,73.03 v98.27,73.23 | v109.7,72.42 v109.7,73.23 | v122.22,72.69 122.22,69.09 v122.43,68.89 | v123.14,68.89 123.14,66.5 v123.34,66.29 | v130.96,53.11 v130.96,66.29 | v133.1,53.09 133.1,51.41 132.64,50.95 132.64,47.37 132.84,47.17 132.84,46.48 132.56,46.2 132.56,39.75 v132.36,39.55 | v129.18,39.55 129.18,33.35 127.64,31.8 v127.64,20.68 | v124.08,20.68 123.88,20.47 123.88,15.62 v124.08,15.42 | v97.31,17.5 v97.31,15.42 | U1.37 v91.44,17.5
  Bottom 0.305: v31.7,38.1 R11.2 | v31.7,41.4 31.9,41.2 37.11,41.2 37.31,41.4 v47.32,41.4 | v47.32,40.69 50.83,40.69 50.9,40.62 52.81,40.62 53.09,40.34 53.7,40.34 53.9,40.54 56.52,40.54 56.72,40.34 v59.97,40.34 | v60.15,68.63 60.35,68.43 66.34,68.43 66.55,68.63 67.36,68.63 67.56,68.83 68.38,68.83 68.58,69.04 69.44,69.04 69.65,69.24 v70.71,69.24 | v70.71,65.73 70.92,65.53 81.41,65.53 v81.61,65.73 | v81.61,66.5 82.86,66.5 83.26,66.09 96.75,66.09 97.18,66.52 v98.27,66.52 | v109.7,73.23 v98.27,73.23 | v109.7,72.42 109.91,72.21 120.02,72.21 120.5,72.69 v122.22,72.69 | v123.14,68.89 v122.43,68.89 | v123.34,66.29 123.55,66.09 130.76,66.09 v130.96,66.29 | v130.96,53.11 131.04,53.11 131.06,53.09 v133.1,53.09 | v129.18,39.55 v132.36,39.55 | v124.08,20.68 v127.64,20.68 | v124.08,15.42 124.05,15.39 123.22,15.39 123.01,15.19 105.31,15.19 105.08,15.42 104.5,15.42 104.09,15.82 100.08,15.82 99.87,15.62 97.51,15.62 v97.31,15.42 | v97.31,17.5 97.1,17.3 91.64,17.3 v91.44,17.5
9A_OUT  (via drill 0.33)
  Top 0.762: v52.07,0.89 J9.P2 | v37.85,1.91 v37.85,0.89 | v14.1,25.04 v14.1,1.78 | v8.89,25.04 Q10.2
  Bottom 0.762: v52.07,0.89 51.94,0.76 37.97,0.76 v37.85,0.89 | v37.85,1.91 36.42,1.91 36.3,1.78 v14.1,1.78 | v8.89,25.04 v14.1,25.04
9B  (via drill 0.33)
  Top 0.305: v35.51,68.76 v35.51,73.66 | v34.57,68.76 34.57,65.23 34.98,64.82 34.98,63.52 35.18,63.32 35.18,62.23 35.38,62.03 35.38,57.07 v35.18,56.87 | v45.85,51.49 v45.85,56.82 | v48.08,51.49 47.88,51.28 47.88,43.69 48.08,43.48 48.08,41.86 | v48.08,39.37 48.08,41.86 | v91.44,24.66 U1.36 | v80.87,24.46 80.42,24.92 80.42,42.42 v80.62,42.62 | v56.26,41.86 v56.26,43.1 | v48.21,41.86 48.08,41.86
  Bottom 0.305: v35.51,73.66 R32.2 | v34.57,68.76 v35.51,68.76 | v35.18,56.87 35.23,56.82 36.8,56.82 37.01,56.62 45.64,56.62 v45.85,56.82 | v48.08,51.49 v45.85,51.49 | C6.2 v48.08,39.37 | v91.44,24.66 91.24,24.46 v80.87,24.46 | v80.62,42.62 80.59,42.65 79.76,42.65 79.55,42.85 77.42,42.85 76.96,43.31 64.9,43.31 64.85,43.26 62.1,43.26 62.05,43.31 56.46,43.31 v56.26,43.1 | v48.21,41.86 v56.26,41.86
9B_OUT  (via drill 0.33)
  Top 0.762: v153.44,36.42 v153.44,41.15 | v150.9,35.46 v150.9,36.42 | v142.85,34.44 v142.85,35.46 | v138.99,32.41 v138.99,34.44 | v116.43,28.65 v116.43,32.41 | v114.71,28.65 114.45,28.4 114.45,25.93 114.4,25.88 v114.4,11.81 | v89.66,10.87 v89.66,11.81 | v62.74,11.89 v62.74,10.87 | J9.P1 v54.61,11.89 | v80.01,89.89 D9.C | v78.23,83.87 v78.23,89.89 | v75.67,83.87 75.67,85.7 75.46,85.9 v75.46,86.89 | v63.75,84.2 v63.75,86.89 | v61.14,84.2 61.14,68.22 60.94,68.02 60.94,67.46 60.71,67.23 60.71,59.61 60.91,59.41 60.91,47.55 60.55,47.19 v60.55,42.52 | v58.42,20.19 v58.42,42.52 | v61.24,20.19 61.24,18.36 61.04,18.16 v61.04,11.89
  Bottom 0.762: v153.44,41.15 IC10.2 | v150.9,36.42 v153.44,36.42 | v142.85,35.46 v150.9,35.46 | v138.99,34.44 v142.85,34.44 | v116.43,32.41 v138.99,32.41 | v114.71,28.65 v116.43,28.65 | v89.66,11.81 v114.4,11.81 | v62.74,10.87 v89.66,10.87 | v54.61,11.89 v61.04,11.89 v62.74,11.89 | v78.23,89.89 v80.01,89.89 | v75.67,83.87 v78.23,83.87 | v63.75,86.89 v75.46,86.89 | v61.14,84.2 v63.75,84.2 | v58.42,42.52 v60.55,42.52 | v61.24,20.19 v58.42,20.19
10A  (via drill 0.33)
  Top 0.305: v31.7,46.48 v31.7,50.8 | v39.88,46.99 v39.88,46.48 | v93.98,15.98 U1.35 | v86.84,15.88 86.84,3.99 v86.64,3.79 | v82.14,3.71 81.94,3.5 81.94,1.45 81.03,0.53 65.94,0.53 v65.94,5.89 | v65.18,5.89 65.18,7.14 65.38,7.34 65.38,7.85 65.96,8.43 65.96,12.98 68.56,15.57 68.56,17.07 67.11,18.52 v67.03,18.52 | v59.97,18.52 59.77,18.72 59.77,37.85 v59.97,38.05 | v47.47,38.05 47.4,38.12 v47.4,38.71 | v46.53,38.71 46.33,38.91 46.33,45.34 v46.53,45.54 | C5.2 v41.91,45.54
  Bottom 0.305: v31.7,50.8 R12.2 | v31.7,46.48 31.9,46.28 39.67,46.28 v39.88,46.48 | C5.2 v39.88,46.99 | v93.98,15.98 93.78,16.18 87.15,16.18 v86.84,15.88 | v86.64,3.79 86.59,3.73 85.93,3.73 85.9,3.71 v82.14,3.71 | v65.18,5.89 v65.94,5.89 | v67.03,18.52 66.83,18.31 62.53,18.31 62.33,18.52 v59.97,18.52 | v47.47,38.05 v59.97,38.05 | v46.53,38.71 v47.4,38.71 | v41.91,45.54 v46.53,45.54
10A_OUT  (via drill 0.33)
  Top 0.762: v44.45,4.88 J10.P2 | v37.85,2.92 v37.85,4.88 | v30.23,3.81 v30.23,2.79 | v16.13,27.08 v16.13,3.81 | v14.12,50.44 v14.12,27.08 | v8.89,50.44 Q11.2
  Bottom 0.762: v37.85,4.88 v44.45,4.88 | v37.85,2.92 36.02,2.92 35.89,2.79 v30.23,2.79 | v16.13,3.81 v30.23,3.81 | v14.12,27.08 v16.13,27.08 | v8.89,50.44 v14.12,50.44
10B  (via drill 0.33)
  Top 0.305: R34.2 v39.37,71.09 39.45,70.97 v39.45,68.12 | v37.41,71.09 37.21,70.89 37.21,65.73 v37.41,65.53 | v35.33,65.53 35.53,65.33 35.53,63.78 35.74,63.58 35.74,62.48 35.94,62.28 35.94,56.57 35.74,56.36 v35.74,52.25 | v36.85,52.25 37.06,52.05 37.06,46.23 37.26,46.02 37.26,43 37.06,42.8 37.06,41.15 36.85,40.95 v36.85,39.37 | v93.98,43.38 U1.34 | v92.3,43.38 92.3,46.2 92.51,46.41 92.51,61.95 v92.28,62.18 | v68.38,66.95 v68.38,62.18 | v57.78,68.12 v57.78,66.95
  Bottom 0.305: v37.41,71.09 v39.37,71.09 | v35.33,65.53 v37.41,65.53 | v36.85,52.25 v35.74,52.25 | C4.2 v36.85,39.37 | v92.3,43.38 v93.98,43.38 | v92.28,62.18 92.08,62.38 68.58,62.38 v68.38,62.18 | v68.38,66.95 67.31,66.95 67.11,66.75 57.99,66.75 v57.78,66.95 | v57.78,68.12 56.13,68.12 55.93,67.92 48.77,67.92 48.56,68.12 v39.45,68.12
10B_OUT  (via drill 0.33)
  Top 0.762: v46.99,9.86 J10.P1 | v60.71,8.84 v60.71,9.86 | v91.69,9.78 v91.69,8.84 | v118.47,9.78 v118.47,27.18 118.47,40.03 118.26,40.23 118.26,42.16 118.29,42.19 v118.29,52.63 | v83.82,89.89 D10.C | v100.61,94.36 v100.61,89.89 | v114.43,85.83 v114.43,94.36 | v115.44,52.63 v115.44,85.83
  Bottom 0.762: v60.71,9.86 v46.99,9.86 | v91.69,8.84 v60.71,8.84 | v118.47,9.78 v91.69,9.78 | v118.47,27.18 IC11.2 | v100.61,89.89 v83.82,89.89 | v114.43,94.36 v100.61,94.36 | v115.44,85.83 v114.43,85.83 | v118.29,52.63 v115.44,52.63
11A  (via drill 0.33)
  Top 0.305: v40.46,43.18 v40.46,45.72 40.59,45.8 40.59,46.13 40.66,46.2 40.66,48.23 40.69,48.26 v40.69,48.59 | v96.52,15.98 U1.33 | v104.8,14.63 v104.8,16.18 | v123.52,14.63 123.32,14.83 123.32,21.26 v123.52,21.46 | v126.67,21.67 126.67,24.43 126.47,24.64 126.47,28.55 v126.67,28.75 | v113.31,29.44 113.11,29.23 113.11,28.65 108.25,23.8 106.27,23.8 106.27,29.77 v106.07,29.97 | v92.66,29.97 92.86,30.18 92.86,42.24 v92.66,42.44 | v90.78,42.44 90.78,44.45 91.19,44.86 91.19,46.71 91.39,46.91 91.39,60.48 v91.19,60.68 | v69.95,68.48 v69.95,61.06 | v59.36,58.78 v59.36,68.07 | v58.12,58.78 57.91,58.57 57.91,55.65 57.71,55.45 57.71,49.02 v57.91,48.82
  Bottom 0.305: v40.46,45.72 R13.2 | C11.2 v40.46,43.18 | v96.52,15.98 96.72,16.18 99.62,16.18 99.82,16.38 104.6,16.38 v104.8,16.18 | v123.52,14.63 v104.8,14.63 | v123.52,21.46 123.72,21.67 v126.67,21.67 | v126.67,28.75 117.45,28.75 116.76,29.44 v113.31,29.44 | v106.07,29.97 105.87,29.77 101.75,29.77 101.55,29.97 v92.66,29.97 | v90.78,42.44 v92.66,42.44 | v91.19,60.68 90.6,61.27 70.16,61.27 v69.95,61.06 | v69.95,68.48 68.83,68.48 68.63,68.28 67.82,68.28 67.61,68.07 66.8,68.07 66.6,67.87 59.56,67.87 v59.36,68.07 | v58.12,58.78 v59.36,58.78 | v57.91,48.82 57.89,48.79 54.66,48.79 54.46,48.59 53.85,48.59 53.65,48.79 50.04,48.79 49.84,48.59 45.47,48.59 45.26,48.79 42.42,48.79 42.22,48.59 v40.69,48.59
11A_OUT  (via drill 0.33)
  Top 0.762: v36.83,0.89 J11.P2 | v0.89,0.89 0.76,1.02 0.76,40.11 v0.89,40.23 | v8.89,40.23 Q12.2
  Bottom 0.762: v36.83,0.89 36.7,0.76 1.02,0.76 v0.89,0.89 | v8.89,40.23 v0.89,40.23
11B  (via drill 0.33)
  Top 0.305: v48.26,67.36 R36.2 | v56.44,67.36 56.44,63.52 56.24,63.32 56.24,56.41 56.03,56.21 v56.03,46.3 | v57.02,41.1 v57.02,46.3 | v53.39,41.1 53.59,40.89 53.59,29.74 v53.39,29.54 | C3.2 v49.53,29.54 | v96.52,23.14 U1.32 | v84.76,25.78 v84.76,23.14 | v74.47,24.46 v74.47,25.98 | v66.47,21.13 v66.47,24.46 | v56.26,21.34 56.24,21.36 56.24,22.2 56.03,22.4 56.03,25.83 55.83,26.04 55.83,29.26 v56.03,29.46
  Bottom 0.305: v56.44,67.36 v48.26,67.36 | v57.02,46.3 v56.03,46.3 | v53.39,41.1 v57.02,41.1 | v49.53,29.54 49.73,29.74 53.19,29.74 v53.39,29.54 53.52,29.46 v56.03,29.46 | v96.52,23.14 96.32,23.34 84.96,23.34 v84.76,23.14 | v84.76,25.78 84.56,25.58 81.64,25.58 81.43,25.78 77.9,25.78 77.7,25.98 v74.47,25.98 | v74.47,24.46 70.56,24.46 70.36,24.26 66.67,24.26 v66.47,24.46 | v66.47,21.13 65.38,21.13 65.18,21.34 64.36,21.34 64.16,21.54 56.46,21.54 v56.26,21.34
11B_OUT  (via drill 0.33)
  Top 0.762: v39.37,9.86 J11.P1 | v45.97,10.87 v45.97,9.86 | v61.72,9.86 v61.72,10.87 | v90.68,10.79 v90.68,9.86 | v117.45,33.43 117.45,27.64 | 117.45,27.64 v117.45,10.79 | v136.96,36.47 v136.96,33.43 | v148.18,41.15 v148.18,36.47 | v87.63,88.88 D11.C | v90.42,87.86 v90.42,88.88 | v105.66,87.86 105.66,85.34 105.61,85.29 105.61,82.3 105.66,82.25 v105.66,70.41 | v106.68,69.39 v106.68,70.41 | v108.08,47.27 v108.08,69.39 | v110.11,27.64 v110.11,47.27 | v117.09,27.64 117.45,27.64
  Bottom 0.762: v45.97,9.86 v39.37,9.86 | v61.72,10.87 v45.97,10.87 | v90.68,9.86 v61.72,9.86 | v117.45,10.79 v90.68,10.79 | v136.96,33.43 v117.45,33.43 | v148.18,36.47 v136.96,36.47 | v148.18,41.15 IC12.2 | v90.42,88.88 v87.63,88.88 | v105.66,87.86 v90.42,87.86 | v106.68,70.41 v105.66,70.41 | v108.08,69.39 v106.68,69.39 | v110.11,47.27 v108.08,47.27 | v117.09,27.64 v110.11,27.64
12A  (via drill 0.33)
  Top 0.305: v33.22,47.04 v33.22,53.34 | v38.94,47.04 38.94,44.65 39.14,44.45 39.14,37.21 v38.94,37.01 | v49.53,37.01 C2.2 49.53,34.54 v49.96,34.11 | v99.06,17.5 U1.31 | v113.41,17.5 113.61,17.7 113.61,23.39 v113.41,23.6 | v100,24.66 v100,23.8 | v92.38,26.54 v92.38,24.66 | v73.71,25.22 v73.71,26.75 | v67.26,25.02 67.26,22.96 67.23,22.94 67.23,20.83 67.16,20.75 v67.16,20.37 | v57.07,20.78 57.02,20.83 57.02,21.64 56.79,21.87 56.79,22.45 56.59,22.66 56.59,26.09 56.39,26.29 56.39,28.75 56.79,29.16 v56.79,33.96
  Bottom 0.305: v33.22,53.34 R14.2 | v33.22,47.04 33.43,46.84 38.73,46.84 v38.94,47.04 | v49.53,37.01 v38.94,37.01 | v113.41,17.5 v99.06,17.5 | v113.41,23.6 113.21,23.8 v100,23.8 | v100,24.66 98.75,24.66 98.55,24.46 92.58,24.46 v92.38,24.66 | v92.38,26.54 81.64,26.54 81.43,26.34 78.16,26.34 77.95,26.54 74.98,26.54 74.78,26.75 v73.71,26.75 | v73.71,25.22 73.51,25.02 70.31,25.02 70.1,24.82 67.46,24.82 v67.26,25.02 | v67.16,20.37 66.17,20.37 65.96,20.57 65.13,20.57 64.92,20.78 64.11,20.78 63.91,20.98 57.28,20.98 v57.07,20.78 | v56.79,33.96 55.17,33.96 54.97,33.76 50.32,33.76 v49.96,34.11
12A_OUT  (via drill 0.33)
  Top 0.762: v29.21,2.79 J12.P2 | v15.11,26.06 v15.11,2.79 | v13.11,55.52 v13.11,26.06 | v8.89,55.52 Q13.2
  Bottom 0.762: v15.11,2.79 v29.21,2.79 | v13.11,26.06 v15.11,26.06 | v8.89,55.52 v13.11,55.52
12B  (via drill 0.33)
  Top 0.305: v34.29,70.31 R38.2 | v37.97,70.31 37.77,70.1 37.77,66.52 v37.97,66.32 | v39.12,63.83 v39.12,66.32 | v55.68,63.83 55.68,56.67 55.47,56.46 55.47,48.79 55.07,48.39 55.07,45.24 55.27,45.03 55.27,43.66 | 55.27,43.66 55.27,33.4 v55.47,33.2 | C1.2 v49.53,33.2 | v99.06,23.9 U1.30 | v80.06,23.93 79.86,24.13 79.86,43.2 v80.06,43.41 | v55.47,43.66 55.27,43.66
  Bottom 0.305: v37.97,70.31 v34.29,70.31 | v39.12,66.32 v37.97,66.32 | v39.12,63.83 39.32,64.03 49.02,64.03 49.23,63.83 v55.68,63.83 | v49.53,33.2 v55.47,33.2 | v99.06,23.9 83.52,23.9 83.31,23.7 80.29,23.7 v80.06,23.93 | v80.06,43.41 77.67,43.41 77.22,43.87 55.68,43.87 v55.47,43.66
12V  (via drill 0.33)
  Top 0.762: v134.21,29.84 v134.21,10.16 | v64.77,84.2 D13.C | v65.25,84.2 v65.25,69.85 65.61,69.67 v65.61,64.75 | v99.26,64.52 99.26,52.6 99.24,52.58 99.24,52.02 99.44,51.82 v99.44,48.31 | IC4.3 v124.46,48.56 | v154.94,36.42 IC8.3 | v154.46,43.81 v154.46,36.42
  Bottom 0.762: IC11.3 IC3.3 129.9,30.2 134.21,30.2 | 134.21,30.2 IC2.3 136.25,30.2 IC6.3 142.6,30.2 IC7.3 148.95,30.2 IC8.3 | v134.21,10.16 J13.1 | v134.21,29.84 134.21,30.2 | v65.25,84.2 v64.77,84.2 | U1.VIN v65.25,69.85 | IC4.3 IC13.3 131.17,44.17 IC5.3 137.52,44.17 IC9.3 143.87,44.17 IC12.3 150.22,44.17 154.46,44.17 | 154.46,44.17 IC10.3 | v65.61,64.75 95.78,64.75 96.01,64.52 v99.26,64.52 | v99.44,48.31 101.6,48.31 101.62,48.28 110.82,48.28 111.1,48.56 v124.46,48.56 | v154.46,36.42 v154.94,36.42 | v154.46,43.81 154.46,44.17
12VB_OUT  (via drill 0.33)
  Top 0.762: v91.44,88.88 D12.C | v108.71,88.88 108.71,70.41 109.09,70.03 109.09,50.19 109.8,49.48 112.42,49.48 112.42,48.59 113.33,47.68 v113.33,47.55 | v125.48,45.87 v125.48,47.55 | v126.14,43.16 v126.14,45.87 | v129.13,41.15 v129.13,43.16
  Bottom 0.762: v108.71,88.88 v91.44,88.88 | v125.48,47.55 v113.33,47.55 | v126.14,45.87 v125.48,45.87 | v129.13,43.16 v126.14,43.16 | v129.13,41.15 IC13.2
AUX1  (via drill 0.33)
  Top 0.305: v119.74,62.23 119.74,65.08 119.53,65.28 119.53,69.65 119.33,69.85 119.33,70.66 118.92,71.07 118.92,86.82 119.13,87.02 119.13,88.01 119.33,88.21 119.33,95.99 119.53,96.19 v119.53,97.51 | J14.3 v123.19,97.51
  Bottom 0.305: v119.74,62.23 U1.4 | v123.19,97.51 v119.53,97.51
AUX2  (via drill 0.33)
  Top 0.305: v118.97,64.77 118.97,69.39 118.77,69.6 118.77,70.41 118.36,70.81 118.36,87.07 118.57,87.27 118.57,88.27 118.77,88.47 v118.77,96.5 | J14.4 v120.65,96.5
  Bottom 0.305: v118.97,64.77 U1.5 | v120.65,96.5 v118.77,96.5
AUX3  (via drill 0.33)
  Top 0.305: v113.31,69.09 v113.31,67.31 | v118.21,69.09 118.21,70.16 117.81,70.56 117.81,87.33 118.01,87.53 v118.01,88.77 | v116.99,88.77 116.79,88.98 116.79,96.98 v116.99,97.18 | J14.5 v118.11,97.18
  Bottom 0.305: v113.31,67.31 U1.6 | v113.31,69.09 113.51,69.29 116.94,69.29 117.14,69.09 v118.21,69.09 | v116.99,88.77 v118.01,88.77 | v118.11,97.18 v116.99,97.18
AUX4  (via drill 0.33)
  Top 0.305: v117.45,69.85 117.25,70.05 v117.25,87.83 | v116.43,87.83 116.23,88.04 v116.23,97.77 | J14.6 v115.57,97.77
  Bottom 0.305: v117.45,69.85 U1.7 | v116.43,87.83 v117.25,87.83 | v115.57,97.77 v116.23,97.77
COLON1  (via drill 0.33)
  Top 0.305: v118.21,57.15 118.21,59.99 117.81,60.4 117.81,65.38 118.21,65.79 v118.21,67.08 | v120.85,67.08 120.65,67.28 120.65,70.16 120.45,70.36 120.45,71.17 120.04,71.58 120.04,86.31 120.24,86.51 120.24,87.5 120.45,87.71 120.45,94.69 v120.67,94.92 | J14.1 v128.27,94.92
  Bottom 0.305: v118.21,57.15 U1.2 | v120.85,67.08 v118.21,67.08 | v120.67,94.92 120.88,95.12 125.22,95.12 125.42,94.92 v128.27,94.92
COLON2  (via drill 0.33)
  Top 0.305: v117.45,59.69 117.25,59.89 117.25,65.89 v117.45,66.09 | v120.29,66.29 120.09,66.5 120.09,69.9 119.89,70.1 119.89,70.92 119.48,71.32 119.48,86.56 119.69,86.77 119.69,87.76 119.89,87.96 119.89,95.48 v120.09,95.68 | J14.2 v125.73,95.68
  Bottom 0.305: v117.45,59.69 U1.3 | v117.45,66.09 120.09,66.09 v120.29,66.29 | v125.73,95.68 v120.09,95.68
GND
  pour Bottom: 0,110.49 163.83,110.49 163.83,0 0,0
  pour Top: 0,110.49 163.83,110.49 163.83,0 0,0
N$1  (via drill 0.33)
  Top 0.305: R1.1 IC1.5 | v106.07,31.75 106.27,31.95 106.27,35.36 v106.07,35.56
  Bottom 0.305: v106.07,31.75 U1.20 | R1.1 v106.07,35.56
N$2  (via drill 0.33)
  Top 0.305: R2.1 102.87,54.13 101.24,52.5 101.24,49.1 101.35,49 | 101.35,49 102.72,47.62 102.87,47.62 IC1.6 | v101.24,29.21 101.24,48.9 101.35,49
  Bottom 0.305: v101.24,29.21 U1.21
N$3
  Top 0.305: Q7.1 95.25,60.2 93.62,58.57 93.62,51.64 95.1,50.16 95.25,50.16 IC1.2
N$4
  Top 0.305: IC1.1 Q7.2
N$5  (via drill 0.33)
  Top 0.305: U2.2 80.01,71.68 82.53,71.68 82.55,71.65 U2.1 v82.55,65.73 | v97.48,46.99 97.61,47.12 97.61,47.27 97.64,47.3 97.64,51.05 97.43,51.26 97.43,53.03 97.46,53.06 97.46,65.33 v97.26,65.53
  Bottom 0.305: v97.48,46.99 IC1.3 | v97.26,65.53 82.75,65.53 v82.55,65.73
N$6  (via drill 0.33)
  Top 0.305: v21.21,43.05 21.01,42.85 21.01,38.63 v21.21,38.43 | Q1.1 v11.43,38.43
  Bottom 0.305: R3.1 21.34,43.18 v21.21,43.05 | v11.43,38.43 v21.21,38.43
N$7  (via drill 0.33)
  Top 0.305: v20.75,57.91 v20.75,55.88 | v13.13,57.91 13.34,58.12 13.34,62.03 v13.13,62.23
  Bottom 0.305: v20.75,55.88 R4.1 | v20.75,57.91 19.68,57.91 19.48,57.71 13.34,57.71 v13.13,57.91 | Q2.1 v13.13,62.23
N$8  (via drill 0.33)
  Top 0.305: v20.95,66.04 20.75,66.24 20.75,69.77 20.95,69.98 v20.95,71.04 | v16.69,71.07 16.48,71.27 16.48,77.14 16.69,77.34 v16.69,78.41 | v14.1,78.41 13.89,78.61 v13.89,82.55
  Bottom 0.305: v20.95,66.04 R5.1 | v20.95,71.04 19.89,71.04 19.68,70.84 16.92,70.84 v16.69,71.07 | v14.1,78.41 v16.69,78.41 | Q3.1 v13.89,82.55
N$9  (via drill 0.33)
  Top 0.305: v20.19,70.28 v20.19,63.5 | v16.13,70.28 15.93,70.48 v15.93,77.65
  Bottom 0.305: v20.19,63.5 R6.1 | v16.13,70.28 v20.19,70.28 | v15.93,77.65 12.32,77.65 12.14,77.47 Q4.1
N$10  (via drill 0.33)
  Top 0.305: v19.74,62.61 v19.74,60.96 | v18.16,62.61 17.96,62.81 v17.96,69.52 | Q5.1 v11.43,69.52
  Bottom 0.305: v19.74,60.96 R7.1 | v18.16,62.61 v19.74,62.61 | v11.43,69.52 v17.96,69.52
N$11  (via drill 0.33)
  Top 0.305: v21.59,58.9 v21.59,58.42 | v19.18,58.9 18.97,59.11 v18.97,64.9 | Q6.1 v11.43,64.69
  Bottom 0.305: v21.59,58.42 R8.1 | v19.18,58.9 v21.59,58.9 | v18.97,64.9 11.63,64.9 v11.43,64.69
N$12  (via drill 0.33)
  Top 0.305: R39.2 v133.35,81.31
  Bottom 0.305: v133.35,81.31 U21.TX
N$14  (via drill 0.33)
  Top 0.305: R40.1 v129.54,73.69 | U22.GND 137.16,80.39 137.52,80.03 137.52,75.39 137.31,75.18 v137.31,73.81
  Bottom 0.305: v129.54,73.69 137.31,73.69 | 137.31,73.69 139.14,73.69 U21.VCC | v137.31,73.81 137.31,73.69
N$15  (via drill 0.33)
  Top 0.305: v141.68,67.31 U21.RX 141.68,73.81 v141.68,74.88 | v129.54,80.54 R40.2 | v138.07,74.88 v138.07,80.54
  Bottom 0.305: D14.A v141.68,67.31 | v129.54,80.54 133.66,80.54 133.86,80.75 137.87,80.75 v138.07,80.54 | v141.68,74.88 v138.07,74.88
N$17  (via drill 0.33)
  Top 0.305: v149.86,49.33 R15.1 | v139.14,49.53 139.34,49.33 139.34,40.36 138.96,39.98 138.96,35.59 139.78,34.77 v139.78,31.42 | v138.96,31.42 138.76,31.22 138.76,27.74 138.96,27.53 138.96,27.05 138.94,27.03 138.94,24.33 v139.14,24.13
  Bottom 0.305: v149.86,49.33 144.47,49.33 144.27,49.53 v139.14,49.53 | v138.96,31.42 v139.78,31.42 | IC2.1 v139.14,24.13
N$19  (via drill 0.33)